# Altium schematic sheet [05] - IMU.SchDoc
size A3; DocumentNumber: 5; SheetNumber: 5; SheetTotal: 9
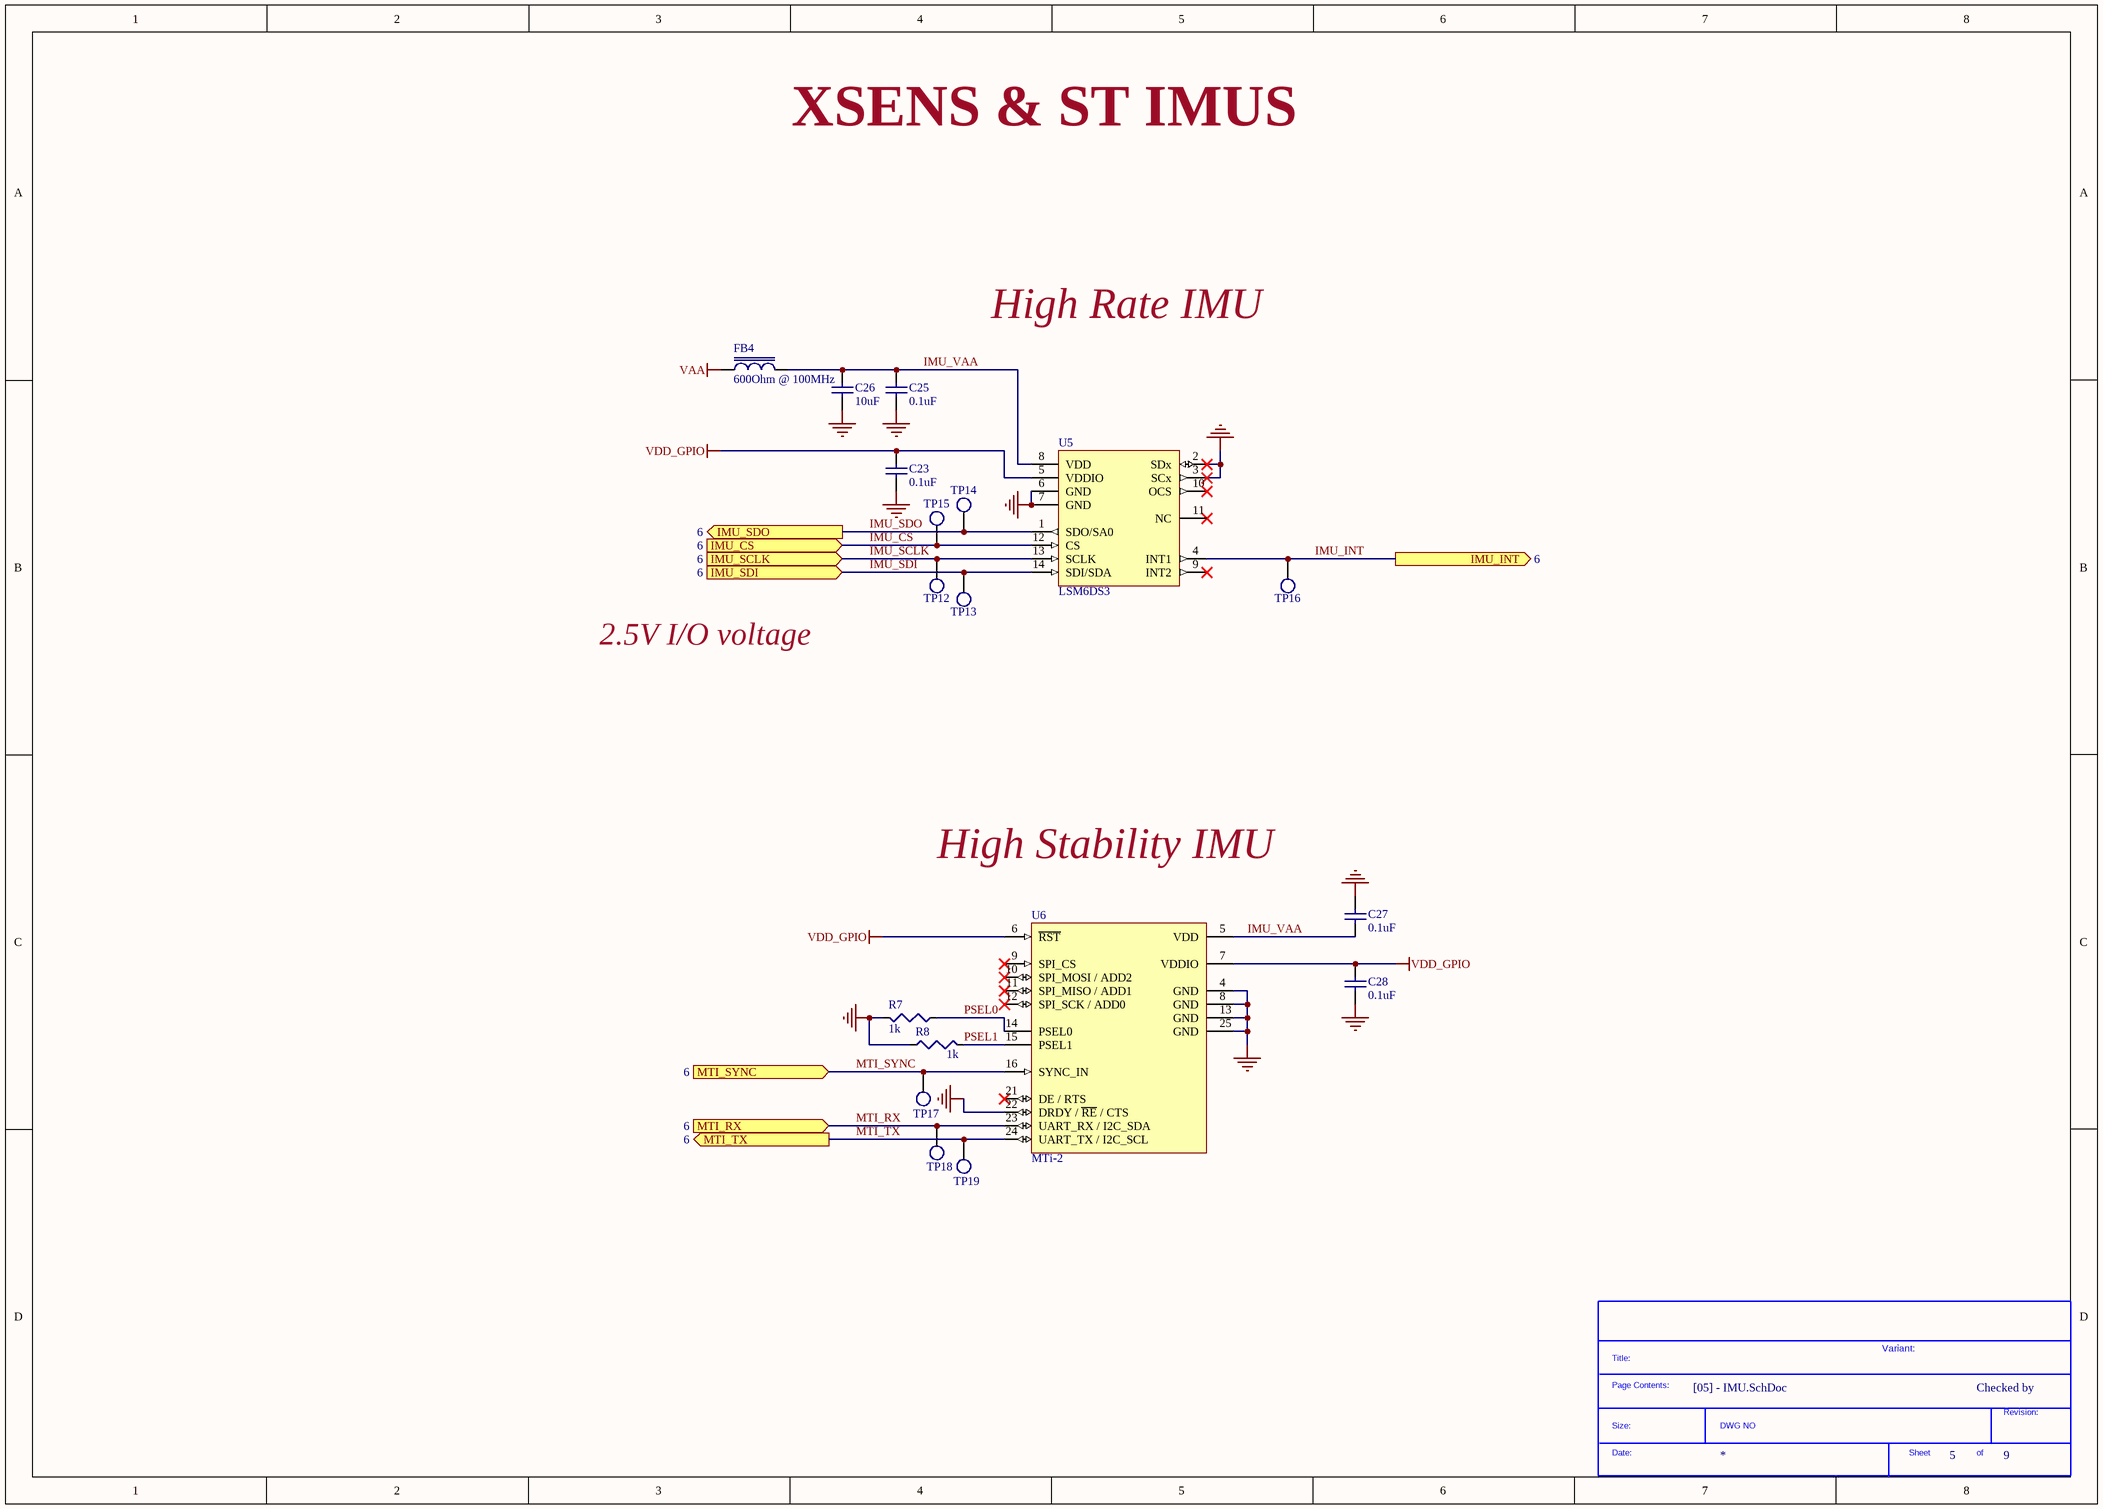
[diagram p0: [05] - IMU.SchDoc]

## Parts
*  SDTitleBlock  (value not drawn)  (graphical)
C23  0.1uF  [C0603L]
C25  0.1uF  [C0603L]
C26  10uF  [C0603L]
C27  0.1uF  [C0603L]
C28  0.1uF  [C0603L]
FB4  600Ohm @ 100MHz  [R0603L]
R7  1k  [R0603L]
R8  1k  [R0603L]
TP12  TestPoint  [TestPoint_1.5mm]  (value not drawn)  (no BOM)
TP13  TestPoint  [TestPoint_1.5mm]  (value not drawn)  (no BOM)
TP14  TestPoint  [TestPoint_1.5mm]  (value not drawn)  (no BOM)
TP15  TestPoint  [TestPoint_1.5mm]  (value not drawn)  (no BOM)
TP16  TestPoint  [TestPoint_1.5mm]  (value not drawn)  (no BOM)
TP17  TestPoint  [TestPoint_1.5mm]  (value not drawn)  (no BOM)
TP18  TestPoint  [TestPoint_1.5mm]  (value not drawn)  (no BOM)
TP19  TestPoint  [TestPoint_1.5mm]  (value not drawn)  (no BOM)
U5  LSM6DS3  [LGA14-N]
U6  MTi-2  [MTi-1]

## Ports
IMU_CS (in, see 6), IMU_INT (out, see 6), IMU_SCLK (in, see 6), IMU_SDI (in, see 6), IMU_SDO (out, see 6), MTI_RX (in, see 6), MTI_SYNC (in, see 6), MTI_TX (out, see 6)

## Nets
GND: C23.2 C25.2 C26.2 C27.1 C28.2 R7.2 R8.1 U5.2(SDx) U5.3(SCx) U5.6(GND) U5.7(GND) U6.4(GND) U6.8(GND) U6.13(GND) U6.22(DRDY_/_~{RE}_/_CTS) U6.25(GND)
VAA: FB4.1
VDD_GPIO: C23.1 C28.1 U5.5(VDDIO) U6.6(~{RST}) U6.7(VDDIO)
IMU_CS: TP15.1 U5.12(CS) ; port IMU_CS
IMU_INT: TP16.1 U5.4(INT1) ; port IMU_INT
IMU_SCLK: TP12.1 U5.13(SCLK) ; port IMU_SCLK
IMU_SDI: TP13.1 U5.14(SDI/SDA) ; port IMU_SDI
IMU_SDO: TP14.1 U5.1(SDO/SA0) ; port IMU_SDO
IMU_VAA: C25.1 C26.1 C27.2 FB4.2 U5.8(VDD) U6.5(VDD)
MTI_RX: TP18.1 U6.23(UART_RX_/_I2C_SDA) ; port MTI_RX
MTI_SYNC: TP17.1 U6.16(SYNC_IN) ; port MTI_SYNC
MTI_TX: TP19.1 U6.24(UART_TX_/_I2C_SCL) ; port MTI_TX
PSEL0: R7.1 U6.14(PSEL0)
PSEL1: R8.2 U6.15(PSEL1)

Not connected (* = marked no-connect by the designer): U5 9(INT2)* 10(OCS)* 11(NC)*; U6 9(SPI_CS)* 10(SPI_MOSI_/_ADD2)* 11(SPI_MISO_/_ADD1)* 12(SPI_SCK_/_ADD0)* 21(DE_/_RTS)*

## Notes on the sheet
- XSENS & ST IMUS
- High Rate IMU
- 2.5V I/O voltage
- High Stability IMU
- CLOCKS (CPU & PCIE)
- Variant:
- Checked by
- (in symbol SDTitleBlock) Title:; Page Contents:; Revision:; Size:; DWG NO; Date:; Sheet; of

## Library data of the parts
C23 C25 C27 C28 = GRM188R71H104KA93J: CAP CER 0.1UF 50V 10% X7R 0603; Manufacturer: Murata Electronics North America; Capacitance: 0.1µF; Supplier 1: Digi-Key; Manufacturer Part Number: GRM188R71H104KA93J; RoHS: RoHS Compliant; Category: Capacitors; Stock 1: 4487; Pricing 1: 1=0.12, 10=0.088, 50=0.048, 100=0.0405, 250=0.03316, 500=0.02838, 1000=0.02211, 5000=0.01843 (EUR); Packaging: Cut Tape (CT); Tolerance: ±10%; Voltage - Rated: 50V; Temperature Coefficient: X7R; Mounting Type: Surface Mount, MLCC; Operating Temperature: -55°C ~ 125°C; Applications: General Purpose; Ratings: -; Package / Case: 0603 (1608 Metric); Size / Dimension: 0.063" L x 0.031" W (1.60mm x 0.80mm); Height - Seated (Max): -; Thickness (Max): 0.035" (0.90mm); Lead Spacing: -; Features: -; Lead Style: -; ComponentLink1URL: http://www.murata.com/~/media/webrenewal/support/library/catalog/products/capacitor/mlcc/c02e.ashx; ComponentLink1Description: http://www.murata.com/~/media/webrenewal/support/library/catalog/products/capacitor/mlcc/c02e.ashx; Supplier Part Number 1: 490-9735-1-ND
C26 = GRM188R61C106MA73D: CAP CER 10UF 16V 20% X5R 0603; Manufacturer: Murata Electronics North America; Capacitance: 10µF; Supplier 1: Digi-Key; Manufacturer Part Number: GRM188R61C106MA73D; RoHS: RoHS Compliant; Category: Capacitors; Stock 1: 1868; Pricing 1: 1=0.18, 10=0.171, 25=0.146, 50=0.1242, 100=0.1195, 250=0.10728, 500=0.10238, 1000=0.08532 (EUR); Packaging: Cut Tape (CT); Tolerance: ±20%; Voltage - Rated: 16V; Temperature Coefficient: X5R; Mounting Type: Surface Mount, MLCC; Operating Temperature: -55°C ~ 85°C; Applications: General Purpose; Ratings: -; Package / Case: 0603 (1608 Metric); Size / Dimension: 0.063" L x 0.031" W (1.60mm x 0.80mm); Height - Seated (Max): -; Thickness (Max): 0.031" (0.80mm); Lead Spacing: -; Features: -; Lead Style: -; ComponentLink1URL: http://www.murata.com/~/media/webrenewal/support/library/catalog/products/capacitor/mlcc/c02e.ashx; ComponentLink1Description: http://www.murata.com/~/media/webrenewal/support/library/catalog/products/capacitor/mlcc/c02e.ashx; Supplier Part Number 1: 490-7201-1-ND
FB4 = MPZ1608S601ATA00: FERRITE CHIP BEAD 600 OHM SMD; Manufacturer: TDK Corporation; Current Rating: 1A; DC Resistance (DCR): 150 mOhm Max; Filter Type: Differential Mode - Single; Supplier 1: Digi-Key; Manufacturer Part Number: MPZ1608S601ATA00; RoHS: RoHS Compliant; Category: Filters; Stock 1: 108962; Pricing 1: 1=0.09, 10=0.07, 100=0.0415, 250=0.0302, 500=0.02768, 1000=0.02391 (EUR); Packaging: Cut Tape (CT); Impedance @ Frequency: 600 Ohm @ 100MHz; Package / Case: 0603 (1608 Metric); Mounting Type: Surface Mount; Height (Max): 0.037" (0.95mm); Size / Dimension: 0.063" L x 0.031" W (1.60mm x 0.80mm); ComponentLink1URL: http://product.tdk.com/en/catalog/datasheets/beads_commercial_power_mpz_en.pdf; ComponentLink1Description: http://product.tdk.com/en/catalog/datasheets/beads_commercial_power_mpz_en.pdf; Supplier Part Number 1: 445-2205-1-ND
R7 R8 = CRCW06031K00FKEA: RES SMD 1K OHM 1% 1/10W 0603; Manufacturer: Vishay Dale; Power (Watts): 0.1W, 1/10W; Temperature Coefficient: ±100ppm/°C; Supplier 1: Digi-Key; Manufacturer Part Number: CRCW06031K00FKEA; RoHS: RoHS Compliant; Category: Resistors; Stock 1: 831888; Pricing 1: 10=0.077, 50=0.0416, 200=0.02385, 1000=0.01628 (EUR); Packaging: Cut Tape (CT); Resistance (Ohms): 1k; Tolerance: ±1%; Composition: Thick Film; Features: Automotive AEC-Q200; Operating Temperature: -55°C ~ 155°C; Package / Case: 0603 (1608 Metric); Supplier Device Package: 0603 (1608 Metric); Size / Dimension: 0.061" L x 0.033" W (1.55mm x 0.85mm); Height: 0.020" (0.50mm); Number of Terminations: 2; ComponentLink1URL: http://www.vishay.com/docs/20035/dcrcwe3.pdf; ComponentLink1Description: http://www.vishay.com/docs/20035/dcrcwe3.pdf; Supplier Part Number 1: 541-1.00KHCT-ND
U5 = LSM6DS3TR: IC MOD 3D ACC/GYRO INEMO 14VFLGA; Manufacturer: STMicroelectronics; Sensor Type: Accelerometer, Gyroscope, 3 Axis; Output Type: I²C, SPI; Supplier 1: Digi-Key; Manufacturer Part Number: LSM6DS3TR; RoHS: RoHS Compliant; Category: Sensors, Transducers; Stock 1: 1809; Pricing 1: 1=3.74, 10=3.01, 100=2.6774, 250=2.4674, 500=2.2224, 1000=1.87241, 2500=1.77617 (EUR); ComponentLink1URL: http://www.st.com/web/en/resource/technical/document/datasheet/DM00133076.pdf; ComponentLink1Description: http://www.st.com/web/en/resource/technical/document/datasheet/DM00133076.pdf; Supplier Part Number 1: 497-15383-1-ND
U6 = MTi-1